# Altium schematic sheet power-converter.SchDoc
size 594 x 420 mm; Address1: Address1; Address2: Address2; Address3: Address3; Address4: Address4; DocumentNumber: АБВГ.123456.001 Э3; SheetNumber: 1; SheetTotal: 4; Scale: 1:1; DocumentType: Схема электрическая принципиальная; FirstReferrence: АБВГ.123456.001
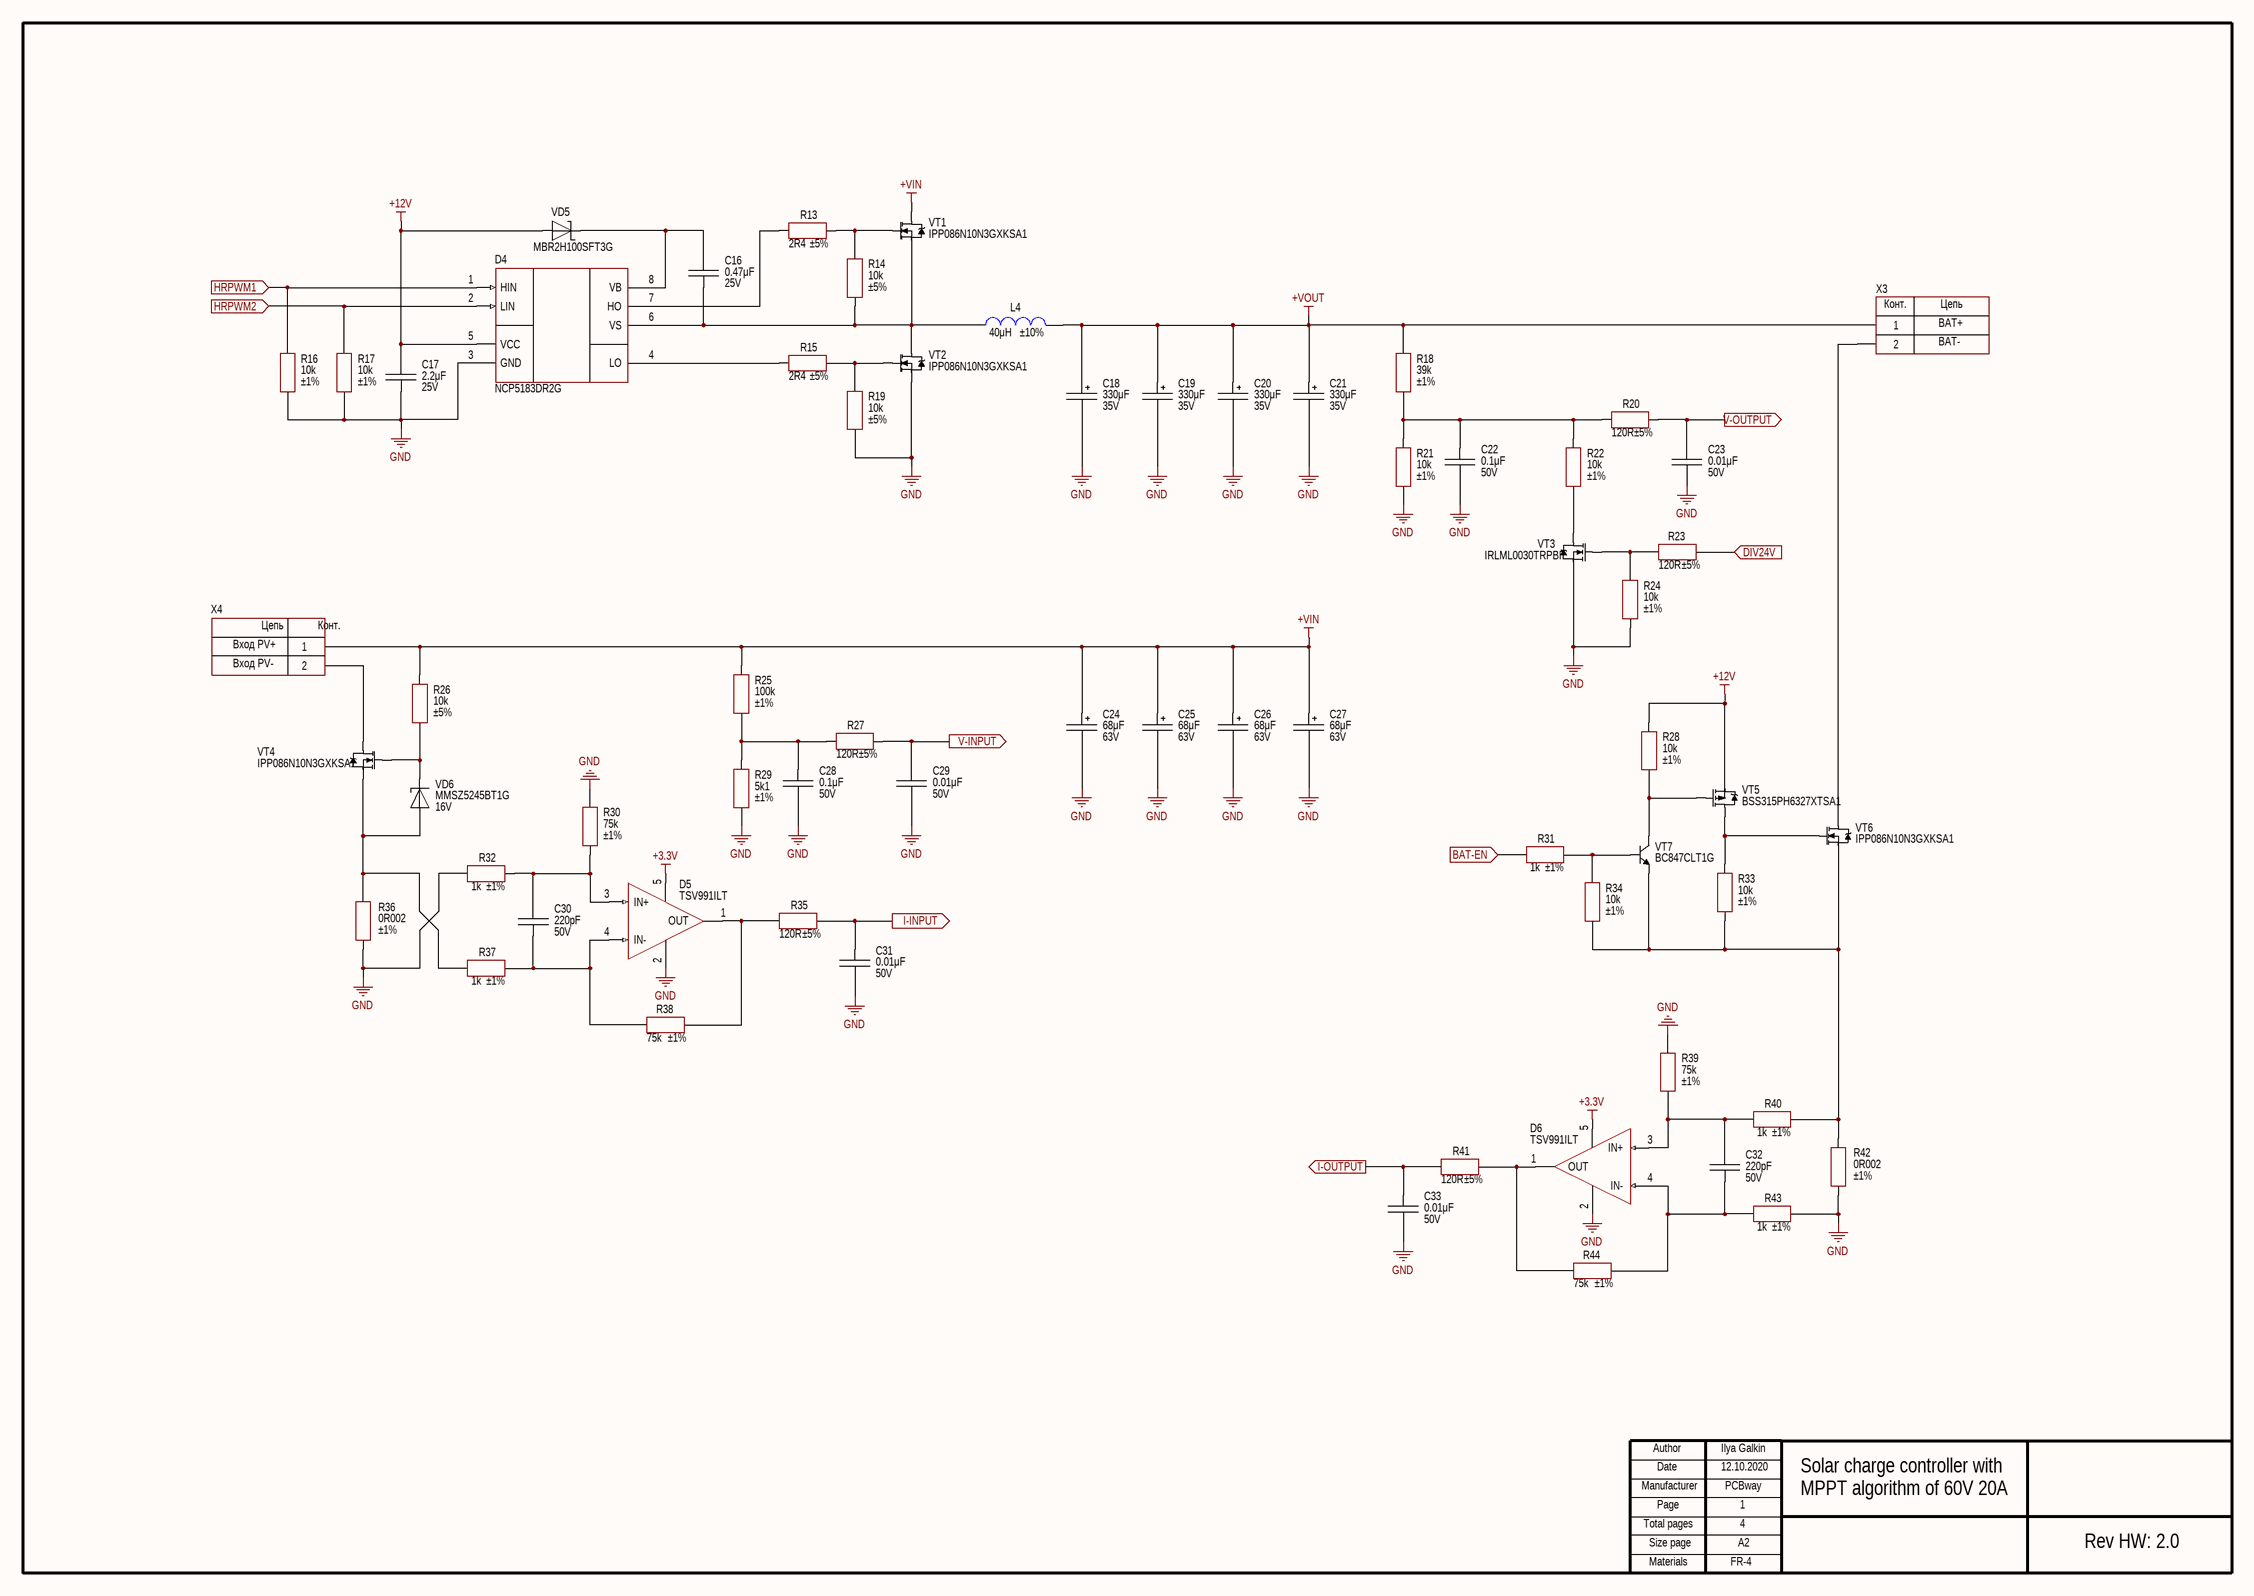
[diagram p0: power-converter.SchDoc]

## Parts
C16  value 0.47μF  Voltage: 25V  [CAP: 0805]
C17  value 2.2μF  Voltage: 25V  [CAP: 0805]
C18  value 330μF  Voltage: 35V  [CAP: D10C5H12.5]
C19  value 330μF  Voltage: 35V  [CAP: D10C5H12.5]
C20  value 330μF  Voltage: 35V  [CAP: D10C5H12.5]
C21  value 330μF  Voltage: 35V  [CAP: D10C5H12.5]
C22  value 0.1μF  Voltage: 50V  [CAP: 0603]
C23  value 0.01μF  Voltage: 50V  [CAP: 0603]
C24  value 68μF  Voltage: 63V  [CAP: D10C5H12.5]
C25  value 68μF  Voltage: 63V  [CAP: D10C5H12.5]
C26  value 68μF  Voltage: 63V  [CAP: D10C5H12.5]
C27  value 68μF  Voltage: 63V  [CAP: D10C5H12.5]
C28  value 0.1μF  Voltage: 50V  [CAP: 0603]
C29  value 0.01μF  Voltage: 50V  [CAP: 0603]
C30  value 220pF  Voltage: 50V  [CAP: 0603]
C31  value 0.01μF  Voltage: 50V  [CAP: 0603]
C32  value 220pF  Voltage: 50V  [CAP: 0603]
C33  value 0.01μF  Voltage: 50V  [CAP: 0603]
D4  (no value)  [8-SOIC]
D5  (no value)  [SOT23-5]
D6  (no value)  [SOT23-5]
L4  value 40μH  Tolerance: ±10%  [IND: R32.8/20.1/10.7 (L)]
R13  value 2R4  Tolerance: ±5%  [RES: 0805]
R14  value 10k  Tolerance: ±5%  [RES: 0805]
R15  value 2R4  Tolerance: ±5%  [RES: 0805]
R16  value 10k  Tolerance: ±1%  [RES: 0603]
R17  value 10k  Tolerance: ±1%  [RES: 0603]
R18  value 39k  Tolerance: ±1%  [RES: 0603]
R19  value 10k  Tolerance: ±5%  [RES: 0805]
R20  value 120R  Tolerance: ±5%  [RES: 0603]
R21  value 10k  Tolerance: ±1%  [RES: 0603]
R22  value 10k  Tolerance: ±1%  [RES: 0603]
R23  value 120R  Tolerance: ±5%  [RES: 0603]
R24  value 10k  Tolerance: ±1%  [RES: 0603]
R25  value 100k  Tolerance: ±1%  [RES: 0805]
R26  value 10k  Tolerance: ±5%  [RES: 0805]
R27  value 120R  Tolerance: ±5%  [RES: 0603]
R28  value 10k  Tolerance: ±1%  [RES: 0603]
R29  value 5k1  Tolerance: ±1%  [RES: 0603]
R30  value 75k  Tolerance: ±1%  [RES: 0603]
R31  value 1k  Tolerance: ±1%  [RES: 0603]
R32  value 1k  Tolerance: ±1%  [RES: 0603]
R33  value 10k  Tolerance: ±1%  [RES: 0603]
R34  value 10k  Tolerance: ±1%  [RES: 0603]
R35  value 120R  Tolerance: ±5%  [RES: 0603]
R36  value 0R002  Tolerance: ±1%  [RES: CSS2H (2512)]
R37  value 1k  Tolerance: ±1%  [RES: 0603]
R38  value 75k  Tolerance: ±1%  [RES: 0603]
R39  value 75k  Tolerance: ±1%  [RES: 0603]
R40  value 1k  Tolerance: ±1%  [RES: 0603]
R41  value 120R  Tolerance: ±5%  [RES: 0603]
R42  value 0R002  Tolerance: ±1%  [RES: CSS2H (2512)]
R43  value 1k  Tolerance: ±1%  [RES: 0603]
R44  value 75k  Tolerance: ±1%  [RES: 0603]
VD5  PartNumber: MBR2H100SFT3G  [DIODE: SOD123F]
VD6  Voltage: 16V  PartNumber: MMSZ5245BT1G  [DIODE: SOD123]
VT1  PartNumber: IPP086N10N3GXKSA1  [TO220(H)]
VT2  PartNumber: IPP086N10N3GXKSA1  [TO220(H)]
VT3  PartNumber: IRLML0030TRPBF  [SOT23]
VT4  PartNumber: IPP086N10N3GXKSA1  [TO220(H)]
VT5  PartNumber: BSS315PH6327XTSA1  [SOT23]
VT6  PartNumber: IPP086N10N3GXKSA1  [TO220(H)]
VT7  PartNumber: BC847CLT1G  [SOT23]
X3  (no value)  [CON: XT60PW-M]
X4  (no value)  [CON: XT60PW-M]

## Ports
BAT-EN (in), DIV24V (in), HRPWM1 (in), HRPWM2 (in), I-INPUT (out), I-OUTPUT (out), V-INPUT (out), V-OUTPUT (out)

## Nets
+3.3V: D5.5(V+) D6.5(V+)
+12V: C17.2 D4.5(VCC) R28.2 VD5.1 VT5.2(S)
+VIN: C24.1 C25.1 C26.1 C27.1 R25.2 R26.2 VT1.2(D) X4.1
+VOUT: C18.1 C19.1 C20.1 C21.1 L4.1 R18.2 X3.1
GND: C17.1 C18.2 C19.2 C20.2 C21.2 C22.1 C23.1 C24.2 C25.2 C26.2 C27.2 C28.1 C29.1 C31.1 C33.1 D4.3(GND) D5.2(V-) D6.2(V-) R16.1 R17.1 R19.1 R21.1 R24.1 R29.1 R30.2 R32.1 R36.1 R39.2 R42.1 R43.2 VT2.3(S) VT3.2(S)
BAT-EN: R31.1 ; port BAT-EN
DIV24V: R23.2 ; port DIV24V
HRPWM1: D4.1(HIN) R16.2 ; port HRPWM1
HRPWM2: D4.2(LIN) R17.2 ; port HRPWM2
I-INPUT: C31.2 R35.2 ; port I-INPUT
I-OUTPUT: C33.2 R41.1 ; port I-OUTPUT
V-INPUT: C29.2 R27.2 ; port V-INPUT
V-OUTPUT: C23.2 R20.2 ; port V-OUTPUT
NetC16_1: C16.1 D4.6(VS) L4.2 R14.1 VT1.3(S) VT2.2(D)
NetC16_2: C16.2 D4.8(VB) VD5.2
NetC22_2: C22.2 R18.1 R20.1 R21.2 R22.2
NetC28_2: C28.2 R25.1 R27.1 R29.2
NetC30_1: C30.1 D5.4(IN-) R37.2 R38.2
NetC30_2: C30.2 D5.3(IN+) R30.1 R32.2
NetC32_1: C32.1 D6.4(IN-) R43.1 R44.1
NetC32_2: C32.2 D6.3(IN+) R39.1 R40.1
NetD4_4: D4.4(LO) R15.2
NetD4_7: D4.7(HO) R13.2
NetD5_1: D5.1(OUT) R35.1 R38.1
NetD6_1: D6.1(OUT) R41.2 R44.2
NetR13_1: R13.1 R14.2 VT1.1(G)
NetR15_1: R15.1 R19.2 VT2.1(G)
NetR22_1: R22.1 VT3.3(D)
NetR23_1: R23.1 R24.2 VT3.1(G)
NetR26_1: R26.1 VD6.2(C) VT4.1(G)
NetR28_1: R28.1 VT5.1(G) VT7.3(C)
NetR31_2: R31.2 R34.2 VT7.1(B)
NetR33_1: R33.1 R34.1 R40.2 R42.2 VT6.3(S) VT7.2(E)
NetR33_2: R33.2 VT5.3(D) VT6.1(G)
NetR36_2: R36.2 R37.1 VD6.1(A) VT4.3(S)
NetVT4_2: VT4.2(D) X4.2
NetVT6_2: VT6.2(D) X3.2

## Notes on the sheet
- BAT+
- BAT-
- Вход PV+
- Вход PV-
- Ilya Galkin
- 12.10.2020
- PCBway
- 1
- Solar charge controller with
- MPPT algorithm of 60V 20A
- 4
- Rev HW: 2.0
- FR-4
- Author
- Manufacturer
- Date
- Page
- Total pages
- Size page
- A2
- Materials
- (in symbol Connector_XT_2pin) Цепь; Конт.

## Library data of the parts
C16 = Ceramic_0805: Manufacturer: Samsung; PartNumber: CL21B474KAFNNNG; ValueManufacturerPartNumber: Ceramic capacitor, 0.47μF, X7R, ±10%, 25V, 0805, -55...+125°C; TypeCapacitor: Ceramic capacitor; Tolerance: ±10%; TypeDielectric: X7R; Package: 0805; HelpURL: https://www.digikey.com/product-detail/en/samsung-electro-mechanics/CL21B474KAFNNNG/1276-6480-1-ND/5958108; Temperature: -55...+125°C
C17 = Ceramic_0805: Manufacturer: Samsung; PartNumber: CL21B225KAFNFNE; ValueManufacturerPartNumber: Ceramic capacitor, 2.2μF, X7R, ±10%, 25V, 0805, -55...+125°C; TypeCapacitor: Ceramic capacitor; Tolerance: ±10%; TypeDielectric: X7R; Package: 0805; HelpURL: https://www.digikey.com/product-detail/en/samsung-electro-mechanics/CL21B225KAFNFNE/1276-2953-1-ND/3891039; Temperature: -55...+125°C
C18-C21 = Aluminium: Manufacturer: Panasonic; PartNumber: 35SEK330M; ValueManufacturerPartNumber: Solid polymer capacitor, 330μF, 35V, ±20%, 18mOhm, 13x10x5 mm, -55...+105°C; TypeCapacitor: Solid polymer capacitor; Tolerance: ±20%; Impedance: 18mOhm; Package: 13x10x5 mm; HelpURL: https://www.digikey.com/product-detail/en/panasonic-electronic-components/35SEK330M/P122629-ND/8030545; Temperature: -55...+105°C
C22 C28 = Ceramic_0603: Manufacturer: Samsung; PartNumber: CL10B104KB8WPND; ValueManufacturerPartNumber: Ceramic capacitor, 0.1μF, X7R, ±10%, 50V, 0603, -55...+125°C; TypeCapacitor: Ceramic capacitor; Tolerance: ±10%; TypeDielectric: X7R; Package: 0603; HelpURL: https://www.digikey.com/product-detail/en/samsung-electro-mechanics/CL10B104KB8WPND/1276-CL10B104KB8WPNDCT-ND/11488014; Temperature: -55...+125°C
C23 C29 C31 C33 = Ceramic_0603: Manufacturer: Samsung; PartNumber: CL10B103KB8NNNC; ValueManufacturerPartNumber: Ceramic capacitor, 0.01μF, X7R, ±10%, 50V, 0603, -55...+125°C; TypeCapacitor: Ceramic capacitor; Tolerance: ±10%; TypeDielectric: X7R; Package: 0603; HelpURL: https://www.digikey.com/product-detail/en/samsung-electro-mechanics/CL10B103KB8NNNC/1276-1009-1-ND/3889095; Temperature: -55...+125°C
C24-C27 = Aluminium: Manufacturer: Panasonic; PartNumber: 63SXE68M; ValueManufacturerPartNumber: Solid polymer capacitor, 68μF, 63V, ±20%, 25mOhm, 13x10x5 mm, -55...+105°C; TypeCapacitor: Solid polymer capacitor; Tolerance: ±20%; Impedance: 25mOhm; Package: 13x10x5 mm; HelpURL: https://www.digikey.com/products/en?keywords=63SXE68M; Temperature: -55...+105°C
C30 C32 = Ceramic_0603: Manufacturer: Samsung; PartNumber: CL10B221KB8NFNC; ValueManufacturerPartNumber: Ceramic capacitor, 220pF, X7R, ±10%, 50V, 0603, -55...+125°C; TypeCapacitor: Ceramic capacitor; Tolerance: ±10%; TypeDielectric: X7R; Package: 0603; HelpURL: https://www.digikey.com/product-detail/en/samsung-electro-mechanics/CL10B221KB8NFNC/1276-1986-1-ND/3890072; Temperature: -55...+125°C
D4 = NCP5183DR2G: Gate driver; Manufacturer: ON Semiconductor; ValueManufacturerPartNumber: Half-bridge gate driver, 600V, 500kHz, ±4.3A, supply 9...18V, -40...+125°C, 8-SOIC; VoltageSupply: supply 9...18V; Frequency: 500kHz; CurrentOutput: ±4.3A; VoltageWork: 600V; HelpURL: https://www.digikey.com/product-detail/en/on-semiconductor/NCP5183DR2G/NCP5183DR2GOSCT-ND/7066807; Package: 8-SOIC; ComponentType: Half-bridge gate driver; Temperature: -40...+125°C; PartNumber: NCP5183DR2G
D5 D6 = TSV991ILT: OP amplifier; Manufacturer: STMicroelectronics; ValueManufacturerPartNumber: IC op amplifier, Rail-to-Rail, 20 MHz, 2.7...5.5V, -40...+125°C, SOT23-5; Supply: 2.7...5.5V; OutputType: Rail-to-Rail; GainBandwidth: 20 MHz; HelpURL: https://www.digikey.com/product-detail/en/stmicroelectronics/TSV991ILT/497-6001-1-ND/1578484; Package: SOT23-5; ComponentType: IC op amplifier; Temperature: -40...+125°C; PartNumber: TSV991ILT
L4 = Inductor_R32.8/20.1/10.7: Manufacturer: Magnetics; PartNumber: 0077548A7; ValueManufacturerPartNumber: Fixed inductor, 40μH, ±10%, R32.8/20.1/10.7, Kool Mu, µ=125, 127 нГн/витков2; TypeInductor: Fixed inductor; TypeMatiriel: Kool Mu; AL: 127 нГн/витков2; MaterialPermeability: µ=125; Package: R32.8/20.1/10.7; HelpURL: http://ferrite.ru/warehouse/r-32-820-110-7-77548-a7.html
R13 R15 = Resistor_0805: Manufacturer: Yageo; PartNumber: RC0805JR-072R4L; ValueManufacturerPartNumber: Resistor film, 2R4, ±5%, 0805, 0.125W, -55...+125°C; TypeResistor: Resistor film; Power: 0.125W; Package: 0805; HelpURL: https://www.digikey.com/product-detail/en/yageo/RC0805JR-072R4L/311-2.4ARCT-ND/731220; Temperature: -55...+125°C
R14 R19 R26 = Resistor_0805: Manufacturer: Yageo; PartNumber: RC0805JR-0710KL; ValueManufacturerPartNumber: Resistor film, 10k, ±5%, 0805, 0.125W, -55...+125°C; TypeResistor: Resistor film; Power: 0.125W; Package: 0805; HelpURL: https://www.digikey.com/product-detail/en/yageo/RC0805JR-0710KL/311-10KARCT-ND/731188; Temperature: -55...+125°C
R16 R17 R21 R22 R24 R28 R33 R34 = Resistor_0603: Manufacturer: Yageo; PartNumber: AC0603FR-0710KL; ValueManufacturerPartNumber: Resistor film, 10k, ±1%, 0603, 0.1W, -55...+125°C; TypeResistor: Resistor film; Power: 0.1W; Package: 0603; HelpURL: https://www.digikey.com/en/products/detail/yageo/AC0603FR-0710KL/2827814; Temperature: -55...+125°C
R18 = Resistor_0603: Manufacturer: Yageo; PartNumber: RC0603FR-0739KL; ValueManufacturerPartNumber: Resistor film, 39k, ±1%, 0603, 0.1W, -55...+125°C; TypeResistor: Resistor film; Power: 0.1W; Package: 0603; HelpURL: https://www.digikey.com/en/products/detail/yageo/RC0603FR-0739KL/727195?s=N4IgTCBcDaIEoGEAMA2JBmAYnAtEg7OgJwDSAMiALoC%2BQA; Temperature: -55...+125°C
R20 R23 R27 R35 R41 = Resistor_0603: Manufacturer: Yageo; PartNumber: RC0603JR-07120RL; ValueManufacturerPartNumber: Resistor film, 120R, ±5%, 0603, 0.1W, -55...+125°C; TypeResistor: Resistor film; Power: 0.1W; Package: 0603; HelpURL: https://www.digikey.com/product-detail/en/yageo/RC0603JR-07120RL/311-120GRCT-ND/729653; Temperature: -55...+125°C
R25 = Resistor_0805: Manufacturer: Yageo; PartNumber: RC0805FR-07100KL; ValueManufacturerPartNumber: Resistor film, 100k, ±1%, 0805, 0.125W, -55...+125°C; TypeResistor: Resistor film; Power: 0.125W; Package: 0805; HelpURL: https://www.digikey.com/product-detail/en/yageo/RC0805FR-07100KL/311-100KCRCT-ND/730491; Temperature: -55...+125°C
R29 = Resistor_0603: Manufacturer: Yageo; PartNumber: RC0603FR-075K1L; ValueManufacturerPartNumber: Resistor film, 5k1, ±1%, 0603, 0.1W, -55...+125°C; TypeResistor: Resistor film; Power: 0.1W; Package: 0603; HelpURL: https://www.digikey.com/en/products/detail/yageo/RC0603FR-075K1L/727268?s=N4IgTCBcDaIEoGEAMA2JBmAYnAtEg7AKwDSAjADIgC6AvkA; Temperature: -55...+125°C
R30 R38 R39 R44 = Resistor_0603: Manufacturer: Yageo; PartNumber: AC0603FR-0775KL; ValueManufacturerPartNumber: Resistor film, 75k, ±1%, 0603, 0.1W, -55...+125°C; TypeResistor: Resistor film; Power: 0.1W; Package: 0603; HelpURL: https://www.digikey.com/en/products/detail/yageo/AC0603FR-0775KL/5896284; Temperature: -55...+125°C
R31 R32 R37 R40 R43 = Resistor_0603: Manufacturer: Yageo; PartNumber: RC0603FR-071KL; ValueManufacturerPartNumber: Resistor film, 1k, ±1%, 0603, 0.1W, -55...+125°C; TypeResistor: Resistor film; Power: 0.1W; Package: 0603; HelpURL: https://www.digikey.com/product-detail/en/yageo/RC0603FR-071KL/311-1-00KHRCT-ND/729790; Temperature: -55...+125°C
R36 R42 = Shunt: Manufacturer: Yageo; PartNumber: PA2512FKM7W0R002E; ValueManufacturerPartNumber: Resistor film, 0R002, ±1%, 2512, 2W, -55...+170°C; TypeResistor: Resistor film; Power: 2W; Package: 2512; HelpURL: https://www.digikey.com/en/products/detail/yageo/PA2512FKM7W0R002E/9696342; Temperature: -55...+170°C
VD5 = Schottky_single: Manufacturer: ON Semiconductor; ValueManufacturerPartNumber: Schottky diode, 100V, 2A, 840mV, 15pF, SOD-123F, -55...+150°C; TypeDiode: Schottky diode; Voltage: 100V; Current: 2A; VoltageDrop: 840mV; RecoveryTime: 15pF; Package: SOD-123F; HelpURL: https://www.digikey.com/product-detail/en/on-semiconductor/MBR2H100SFT3G/MBR2H100SFT3GOSCT-ND/3462288; Temperature: -55...+150°C
VD6 = Zener_single: Manufacturer: ON Semiconductor; ValueManufacturerPartNumber: Zener diode, 16V, 500mW, 0.9V, 16Ohm, SOD-123, -55...+150°C; TypeDiode: Zener diode; Current: 500mW; VoltageDrop: 0.9V; RecoveryTime: 16Ohm; Package: SOD-123; HelpURL: https://www.digikey.com/product-detail/en/on-semiconductor/MMSZ5245BT1G/MMSZ5245BT1GOSCT-ND/1139899; Temperature: -55...+150°C
VT1 VT2 VT4 VT6 = MOSFET_N_123: Manufacturer: Infineon Technologies; ValueManufacturerPartNumber: MOSFET N-channel transistor, 100V, 80A, 55nC, 125W, 8.6mOhm, 3980pF, TO-220, -55...+150°C; TypeTransistor: MOSFET N-channel transistor; VoltageDS: 100V; CurrentDS: 80A; RDS: 8.6mOhm; GateCharge: 55nC; InputCapacitor: 3980pF; MaxPower: 125W; Package: TO-220; HelpURL: https://www.digikey.com/en/products/detail/infineon-technologies/IPP086N10N3GXKSA1/2081155; Temperature: -55...+150°C
VT3 = MOSFET_N_132: Manufacturer: Infineon Technologies; ValueManufacturerPartNumber: MOSFET N-channel transistor, 30V, 5.3A, 2.6nC, 1.3W, 27mOhm, 382pF, SOT-23, -55...+150°C; TypeTransistor: MOSFET N-channel transistor; VoltageDS: 30V; CurrentDS: 5.3A; RDS: 27mOhm; GateCharge: 2.6nC; InputCapacitor: 382pF; MaxPower: 1.3W; Package: SOT-23; HelpURL: https://www.digikey.com/product-detail/en/infineon-technologies/IRLML0030TRPBF/IRLML0030TRPBFCT-ND/2202231; Temperature: -55...+150°C
VT5 = MOSFET_P_132: Manufacturer: Infineon Technologies; ValueManufacturerPartNumber: MOSFET P-channel transistor, 30V, 1.5A, 2.3nC, 500mW, 150mOhm, 282pF, SOT-23, -55...+150°C; TypeTransistor: MOSFET P-channel transistor; VoltageDS: 30V; CurrentDS: 1.5A; RDS: 150mOhm; GateCharge: 2.3nC; InputCapacitor: 282pF; MaxPower: 500mW; Package: SOT-23; HelpURL: https://www.digikey.com/en/products/detail/infineon-technologies/BSS315PH6327XTSA1/2783468; Temperature: -55...+150°C
VT7 = BJT_NPN_132: Manufacturer: ON Semiconductor; ValueManufacturerPartNumber: NPN transistor, 45V, 100mA, 100MHz, 300mW, 0.6V, 420, SOT-23, -55...+125°C; TypeTransistor: NPN transistor; VoltageCE: 45V; CurrentCE: 100mA; VoltageSaturation: 0.6V; Frequency: 100MHz; CurrentGain: 420; MaxPower: 300mW; Package: SOT-23; HelpURL: https://www.digikey.com/product-detail/en/on-semiconductor/BC847CLT1G/BC847CLT1GOSCT-ND/917836; Temperature: -55...+125°C
X3 X4 = Connector_XT_2pin: Manufacturer: AMASS; ValueManufacturerPartNumber: Power connector, 2pin, 7.2mm, 500V, 60A; PartNumber: XT60PW-M; TypeConnector: Power connector; VoltageMax: 500V; Pitch: 7.2mm; CurrentMax: 60A; Multichannel: 2pin; CommentText: "Разъем"; HelpURL: https://lcsc.com/product-detail/Connectors_Changzhou-Amass-Elec-XT60PW-M_C98732.html